# EAGLE design Control2 (EAGLE 7.5.0)
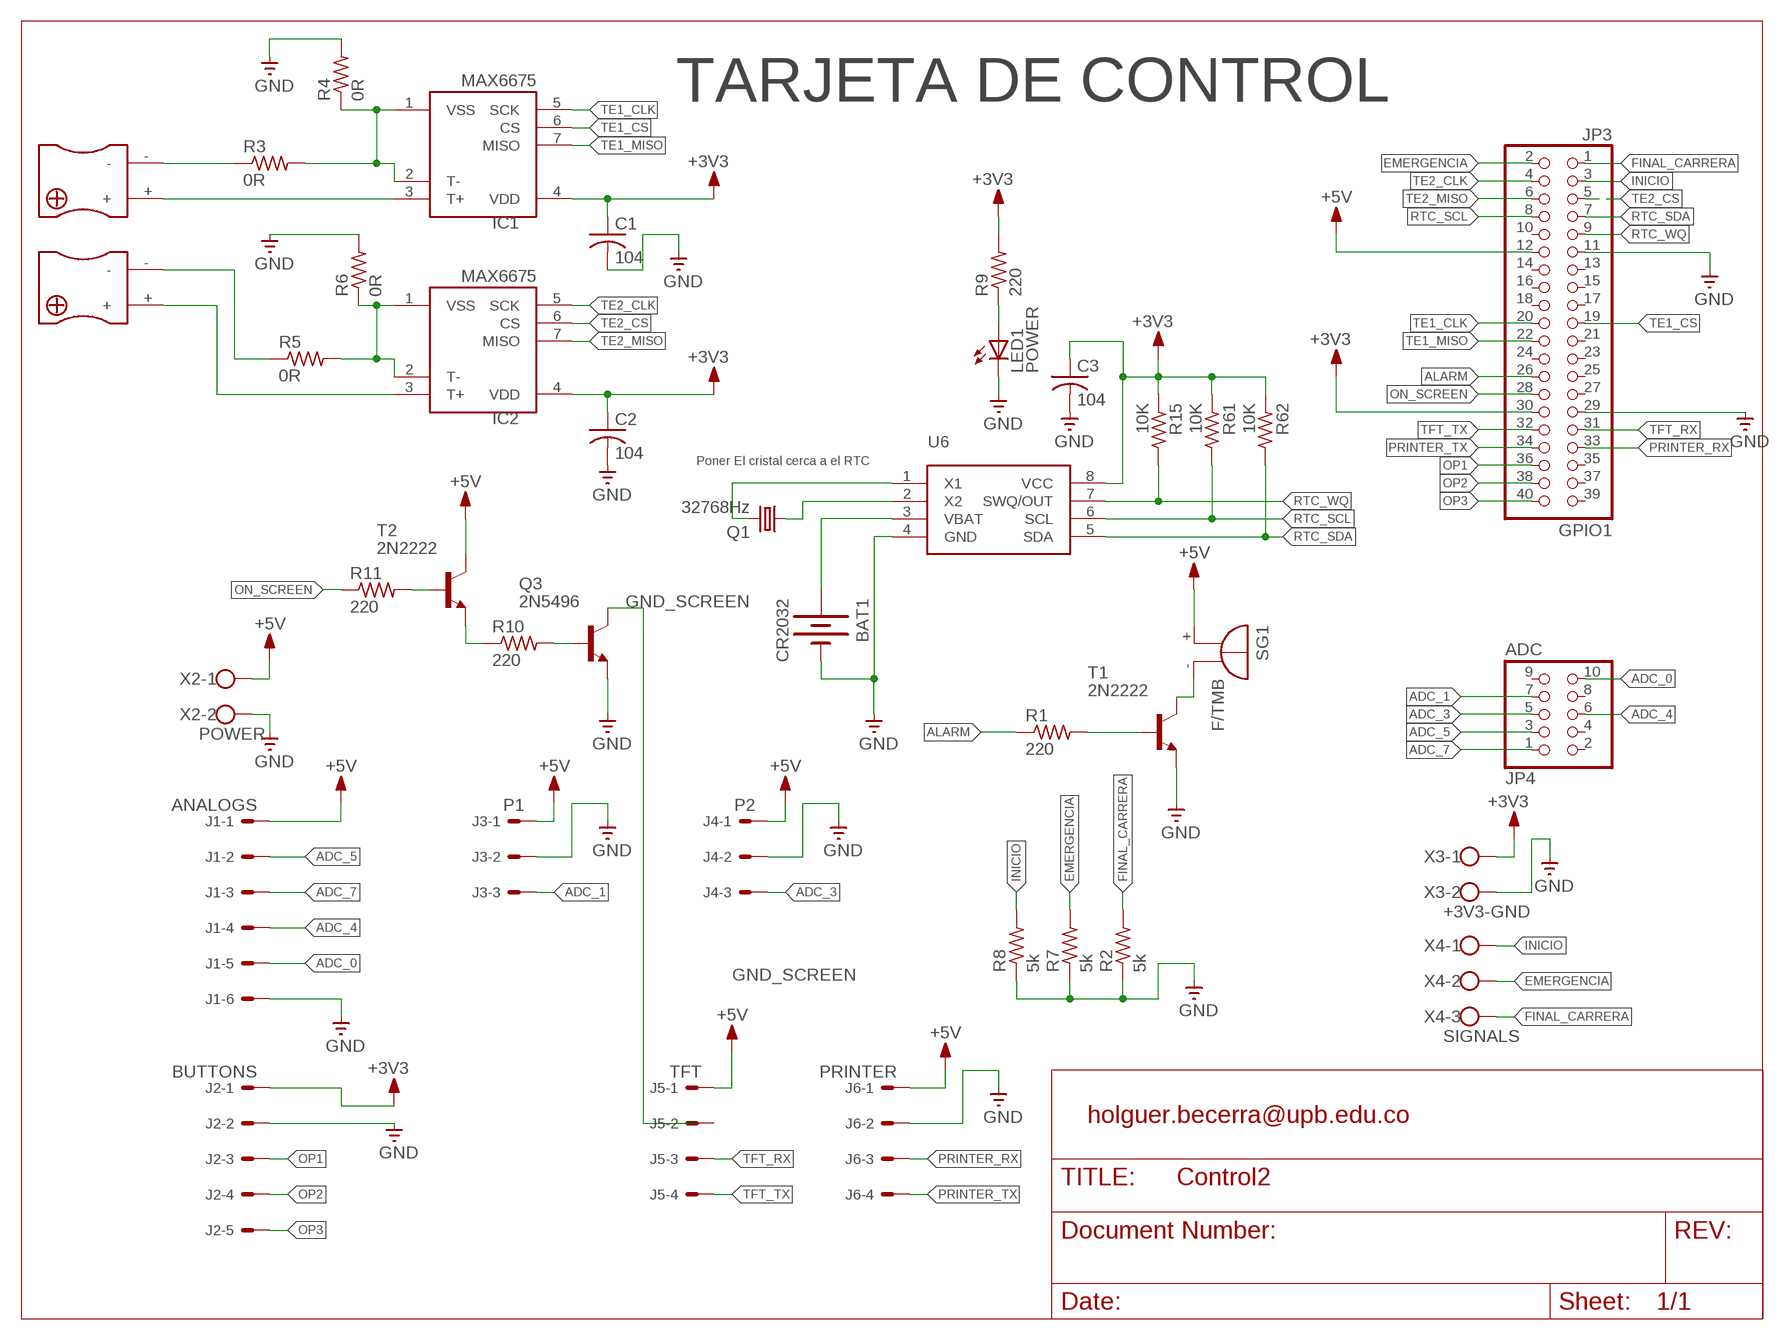
[diagram p0: schematic, sheet 1]

## Parts
BAT1  CR2032  BATTERY20PTH  [BATTCOM_20MM_PTH]
C1  104  C-USC0805  [C0805]
C2  104  C-USC0805  [C0805]
C3  104  C-USC0805  [C0805]
IC1  MAX6675  [SO08]
IC2  MAX6675  [SO08]
J1  ANALOGS  22-27-2061-06  [6410-06]
J2  BUTTONS  22-27-2051-05  [6410-05]
J3  P1  22-27-2031-03  [6410-03]
J4  P2  22-27-2031-03  [6410-03]
J5  TFT  22-27-2041-04  [6410-04]
J6  PRINTER  22-27-2041-04  [6410-04]
JP3  GPIO1  PINHD-2X20  [2X20]
JP4  ADC  PINHD-2X5  [2X05]
LED1  POWER  LED3MM  [LED3MM]
Q1  32768Hz  CRYSTALTC26H  [TC26H]
Q3  2N5496  [TO220]
R1  220  R-US_0207/7  [0207/7]
R2  5k  R-US_0207/7  [0207/7]
R3  0R  R-US_M1206  [M1206]
R4  0R  R-US_M1206  [M1206]
R5  0R  R-US_M1206  [M1206]
R6  0R  R-US_M1206  [M1206]
R7  5k  R-US_0207/7  [0207/7]
R8  5k  R-US_0207/7  [0207/7]
R9  220  R-US_0207/7  [0207/7]
R10  220  R-US_0207/7  [0207/7]
R11  220  R-US_0207/7  [0207/7]
R15  10K  R-US_R0603  [R0603]
R61  10K  R-US_R0603  [R0603]
R62  10K  R-US_R0603  [R0603]
SG1  F/TMB  [F/TMB]
T1  2N2222  2N2222-NPN-TO92-EBC  [TO92-EBC]
T2  2N2222  2N2222-NPN-TO92-EBC  [TO92-EBC]
U6  DS1338  [SO08]
U$1  THERMOCOUPLEPLUG_MINI  [TC-MINI]
U$4  THERMOCOUPLEPLUG_MINI  [TC-MINI]
X2  POWER  CBE2  [BE2]
X3  +3V3-GND  CBE2  [BE2]
X4  SIGNALS  CBE3  [BE3]

## Nets
5VCC: J1.1 J3.1 J4.1 J6.1 JP3.12 SG1.+ T2.C X2.1 ; supply symbol labelled +5V
+3V3: C1.1 C2.1 C3.1 IC1.4(VDD) IC2.4(VDD) J2.1 JP3.30 R9.2 R15.1 R61.1 R62.1 U6.8(VCC) X3.1
ADC_0: J1.5 JP4.10
ADC_1: J3.3 JP4.7
ADC_3: J4.3 JP4.5
ADC_4: J1.4 JP4.6
ADC_5: J1.2 JP4.3
ADC_7: J1.3 JP4.1
ALARM: JP3.26 R1.1
EMERGENCIA: JP3.2 R7.2 X4.2
FINAL_CARRERA: JP3.1 R2.2 X4.3
GND: BAT1.2(-) C1.2 C2.2 C3.2 J1.6 J2.2 J3.2 J4.2 J6.2 JP3.11 JP3.29 LED1.K(C) Q3.3(E) R2.1 R4.2 R6.2 R7.1 R8.1 T1.E U6.4(GND) X2.2 X3.2
INICIO: JP3.3 R8.2 X4.1
N$1: Q1.2 U6.1(X1)
N$2: LED1.A R9.1
N$4: SG1.- T1.C
N$5: R1.2 T1.B
N$6: IC1.3(T+) U$1.+
N$7: R5.1 U$4.-
N$8: IC2.3(T+) U$4.+
N$9: Q1.1 U6.2(X2)
N$10: R10.1 T2.E
N$11: R3.1 U$1.-
N$12: Q3.1(B) R10.2
N$13: R11.2 T2.B
N$30: IC2.1(VSS) IC2.2(T-) R5.2 R6.1
N$31: IC1.1(VSS) IC1.2(T-) R3.2 R4.1
N$35: BAT1.1(+) U6.3(VBAT)
ON_SCREEN: JP3.28 R11.1
OP1: J2.3 JP3.36
OP2: J2.4 JP3.38
OP3: J2.5 JP3.40
PRINTER_RX: J6.3 JP3.33
PRINTER_TX: J6.4 JP3.34
RTC_SCL: JP3.8 R61.2 U6.6(SCL)
RTC_SDA: JP3.7 R62.2 U6.5(SDA)
RTC_WQ: JP3.9 R15.2 U6.7(SWQ/OUT)
TE1_CLK: IC1.5(SCK) JP3.20
TE1_CS: IC1.6(CS) JP3.19
TE1_MISO: IC1.7(MISO) JP3.22
TE2_CLK: IC2.5(SCK) JP3.4
TE2_CS: IC2.6(CS) JP3.5
TE2_MISO: IC2.7(MISO) JP3.6
TFT_RX: J5.3 JP3.31
TFT_TX: J5.4 JP3.32
VCC: J5.1 ; supply symbol labelled +5V
Unconnected: J5.2 JP3.10 JP3.13 JP3.14 JP3.15 JP3.16 JP3.17 JP3.18 JP3.21 JP3.23 JP3.24 JP3.25 JP3.27 JP3.35 JP3.37 JP3.39 JP4.2 JP4.4 JP4.8 JP4.9 Q3.2(C)

## Notes on the sheet
- TARJETA DE CONTROL
- Poner El cristal cerca a el RTC
- holguer.becerra@upb.edu.co

## Library data of the parts
BAT1 = SparkFun:BATTERY: Battery Holders Various common sizes : AA, AAA, 20mm coin cell and 12mm coin cell.
C1-C3 = rcl:C-US: CAPACITOR, American symbol
IC1 IC2 = max6675:MAX6675
J1 = con-molex:22-?-06: CONNECTOR wire to board 2.54 mm (.1 inch) pitch header; OC_FARNELL: unknown; OC_NEWARK: unknown
J2 = con-molex:22-?-05: CONNECTOR wire to board 2.54 mm (.1 inch) pitch header; OC_FARNELL: unknown; OC_NEWARK: unknown
J3 J4 = con-molex:22-?-03: CONNECTOR wire to board 2.54 mm (.1 inch) pitch header; OC_FARNELL: unknown; OC_NEWARK: unknown
J5 J6 = con-molex:22-?-04: CONNECTOR wire to board 2.54 mm (.1 inch) pitch header; OC_FARNELL: unknown; OC_NEWARK: unknown
JP3 = pinhead:PINHD-2X20: PIN HEADER
JP4 = pinhead:PINHD-2X5: PIN HEADER
LED1 = adafruit:LED: LED OSRAM: - CHIPLED LG R971, LG N971, LY N971, LG Q971, LY Q971, LO R971, LY R971 LH N974, LH R974 LS Q976, LO Q976, LY Q976 LO Q996 - Hyper CHIPLED LW Q18S LB Q993, LB Q99A, LB R99A - SideLED LS A670, LO A670, LY A670, LG A670, LP A670 LB A673, LV A673, LT A673, LW A673 LH A674 LY A675 LS A676, LA A676, LO A676, LY A676, LW A676 LS A679, LY A679, LG A679 - Hyper Micro SIDELED® LS Y876, LA Y876, LO Y876, LY Y876 LT Y87S - SmartLED LW L88C, LW L88S LB L89C, LB L89S, LG L890 LS L89K, LO L89K, LY L89K LS L896, LA L896, LO L896, LY L896 - TOPLED LS T670, LO T670, LY T670, LG T670, LP T670 LSG T670, LSP T670, LSY T670, LOP T670, LYG T670 LG T671, LOG T671, LSG T671 LB T673, LV T673, LT T673, LW T673 LH T674 LS T676, LA T676, LO T676, LY T676, LB T676, LH T676, LSB T676, LW T676 LB T67C, LV T67C, LT T67C, LS T67K, LO T67K, LY T67K, LW E67C LS E67B, LA E67B, LO E67B, LY E67B, LB E67C, LV E67C, LT E67C LW T67C LS T679, LY T679, LG T679 LS T770, LO T770, LY T770, LG T770, LP T770 LB T773, LV T773, LT T773, LW T773 LH T774 LS E675, LA E675, LY E675, LS T675 LS T776, LA T776, LO T776, LY T776, LB T776 LHGB T686 LT T68C, LB T68C - Hyper Mini TOPLED® LB M676 - Mini TOPLED Santana® LG M470 LS M47K, LO M47K, LY M47K Source: http://www.osram.convergy.de/
Q1 = crystal:CRYSTAL: CRYSTAL; OC_FARNELL: unknown; OC_NEWARK: unknown
Q3 = transistor:2N5496: NPN TRANSISTOR
R1-R11 = resistor:R-US_: RESISTOR, American symbol
R15 R61 R62 = rcl:R-US_: RESISTOR, American symbol
SG1 = buzzer:F/TMB: BUZZER Source: Buerklin
T1 T2 = transistor-neu-to92:*-NPN-: NPN Transistror
U6 = STERICLINIC:DS1338
U$1 U$4 = max6675:THERMOCOUPLEPLUG_MINI
X2 X3 = Bornera_tornillo_enchufable:CBE2
X4 = Bornera_tornillo_enchufable:CBE3

## Board
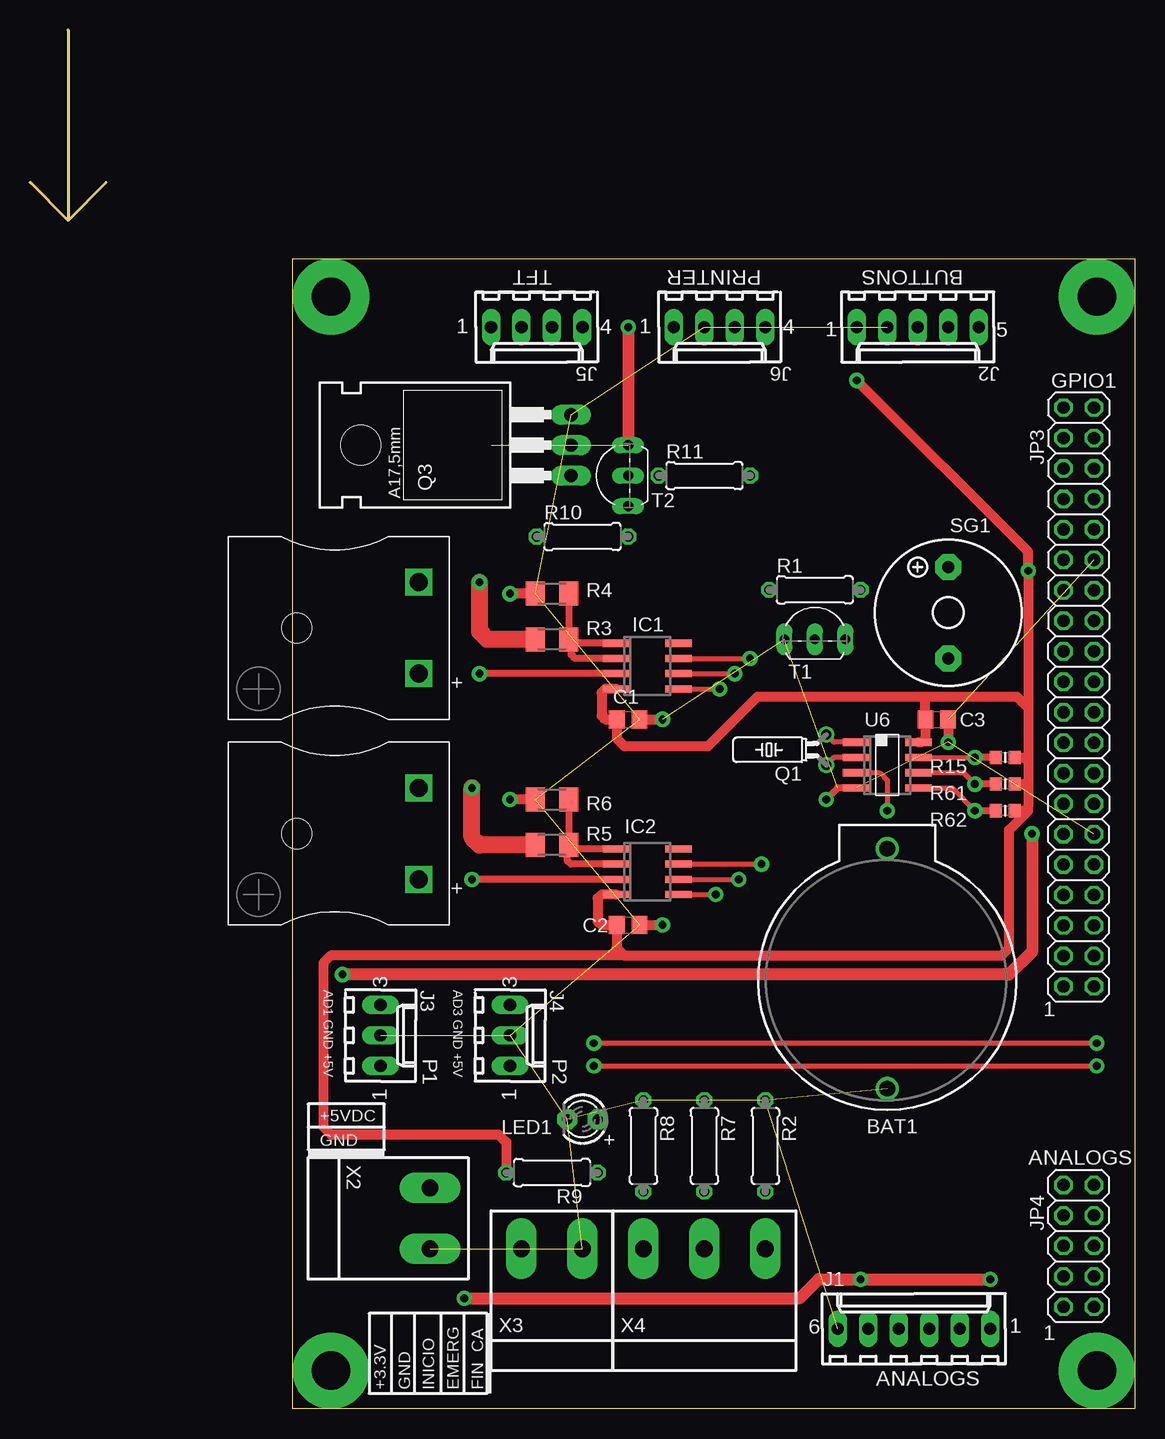
[diagram p1: board, top side]
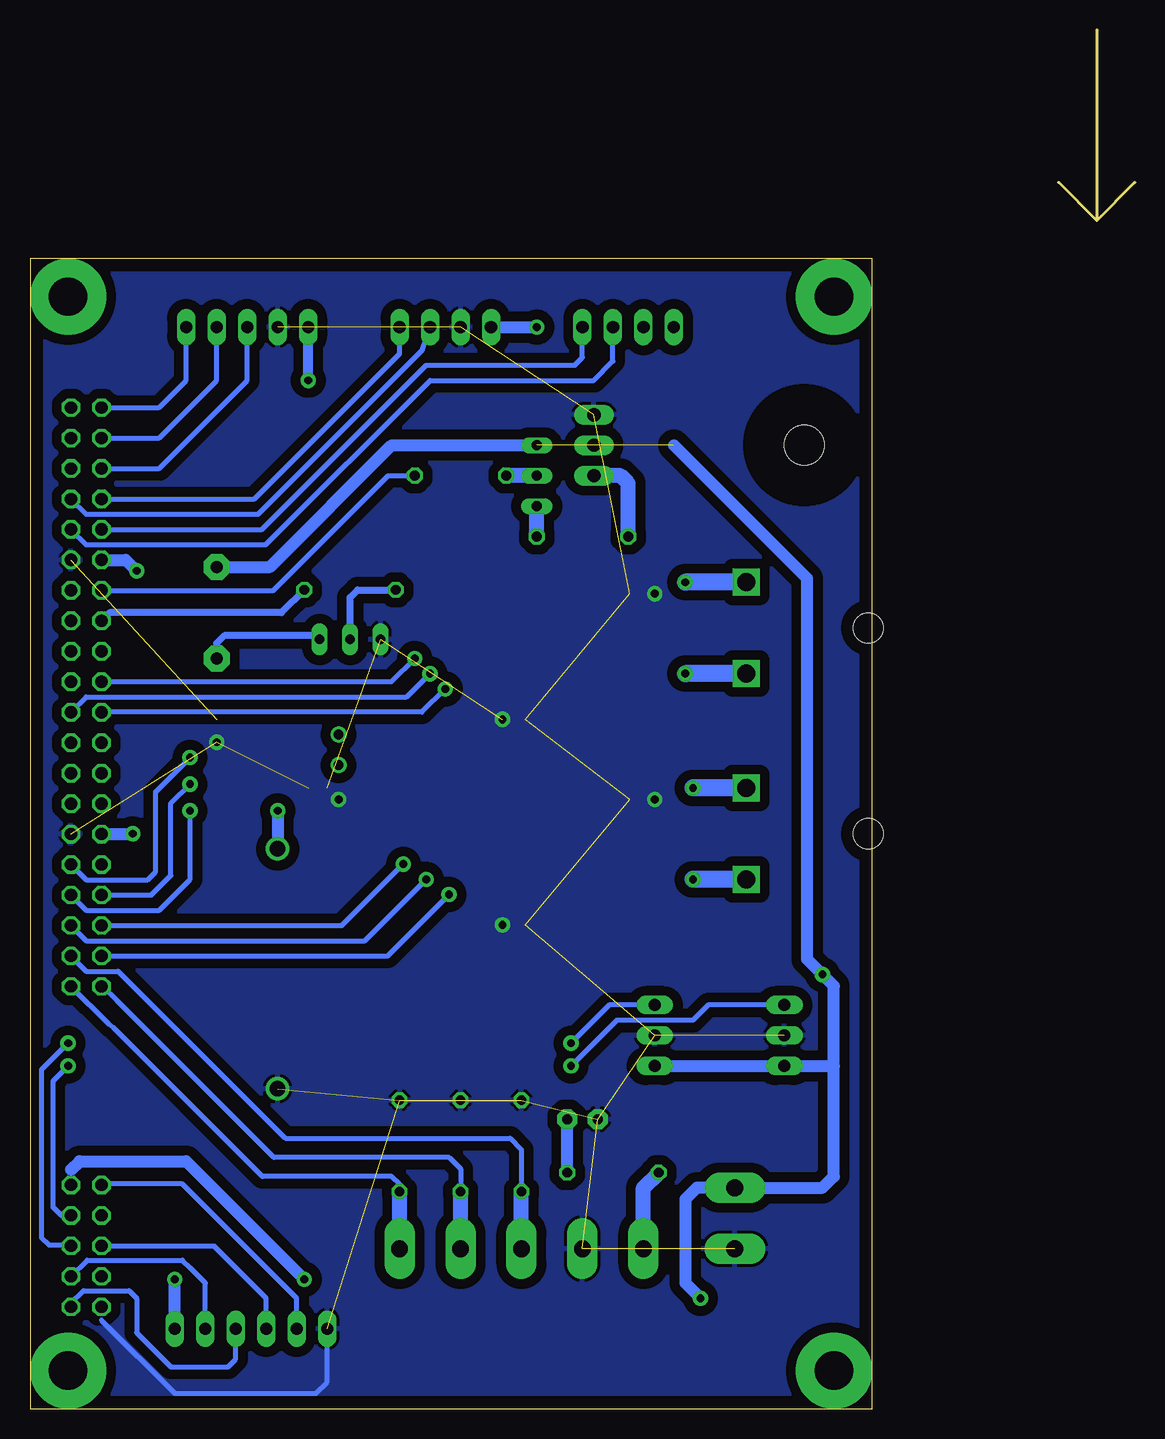
[diagram p2: board, bottom side, seen from below]

Size 92.08 x 114.94 mm. Coordinates in mm from the lower left corner, seen from the top.
Outline: 3.17,114.94 3.17,99.06
Outline: 3.17,99.06 0,102.23
Outline: 6.35,102.23 3.17,99.06
Outline: 92.08,0 21.91,0 21.91,95.89 92.08,95.89 92.08,0
Copper layers (1*16): Top 0.035mm / dielectric 1.5mm / Bottom 0.035mm
Design rules "default": minimum track width 10mil, minimum drill 24mil, track to track 8mil, track to pad 8mil, pad to pad 8mil, via to via 8mil, smd to smd 8mil, copper to edge 40mil, drill to drill 8mil, minimum pad ring 10mil, minimum via ring 8mil, stop-mask expansion 4mil, vias tented up to drill 0mil, thermal gap 10mil

### Footprints (pad centres in the part's own frame; a part is rotated, then mirrored left to right if it is on the bottom)
BATTCOM_20MM_PTH = drill 1.3: 1 20,0; 2 0,0
C0805 = smd 1.3 x 1.5: 1 -0.95,0; 2 0.95,0
SO08 = smd 0.6 x 2.2: 1 -1.905,-2.6; 2 -0.635,-2.6; 3 0.635,-2.6; 4 1.905,-2.6; 5 1.905,2.6; 6 0.635,2.6; 7 -0.635,2.6; 8 -1.905,2.6
6410-06 = drill 1.016 long: 1 6.35,0; 2 3.81,0; 3 1.27,0; 4 -1.27,0; 5 -3.81,0; 6 -6.35,0
6410-05 = drill 1.016 long: 1 5.08,0; 2 2.54,0; 3 0,0; 4 -2.54,0; 5 -5.08,0
6410-03 = drill 1.016 long: 1 2.54,0; 2 0,0; 3 -2.54,0
6410-04 = drill 1.016 long: 1 3.81,0; 2 1.27,0; 3 -1.27,0; 4 -3.81,0
2X20 = drill 1.016 octagon: 1 -24.13,-1.27; 2 -24.13,1.27; 3 -21.59,-1.27; 4 -21.59,1.27; 5 -19.05,-1.27; 6 -19.05,1.27; 7 -16.51,-1.27; 8 -16.51,1.27; 9 -13.97,-1.27; 10 -13.97,1.27; 11 -11.43,-1.27; 12 -11.43,1.27; 13 -8.89,-1.27; 14 -8.89,1.27; 15 -6.35,-1.27; 16 -6.35,1.27; 17 -3.81,-1.27; 18 -3.81,1.27; 19 -1.27,-1.27; 20 -1.27,1.27; 21 1.27,-1.27; 22 1.27,1.27; 23 3.81,-1.27; 24 3.81,1.27; 25 6.35,-1.27; 26 6.35,1.27; 27 8.89,-1.27; 28 8.89,1.27; 29 11.43,-1.27; 30 11.43,1.27; 31 13.97,-1.27; 32 13.97,1.27; 33 16.51,-1.27; 34 16.51,1.27; 35 19.05,-1.27; 36 19.05,1.27; 37 21.59,-1.27; 38 21.59,1.27; 39 24.13,-1.27; 40 24.13,1.27
2X05 = drill 1.016 octagon: 1 -5.08,-1.27; 2 -5.08,1.27; 3 -2.54,-1.27; 4 -2.54,1.27; 5 0,-1.27; 6 0,1.27; 7 2.54,-1.27; 8 2.54,1.27; 9 5.08,-1.27; 10 5.08,1.27
LED3MM = drill 0.813 pad 1.676 octagon: A -1.27,0; K 1.27,0
TC26H = drill 0.813: 1 -1.27,0; 2 1.27,0
TO220 = drill 1.118 long: 1 -2.54,-6.35; 2 0,-6.35; 3 2.54,-6.35 | hole 3.302: 0,11.176
0207/7 = drill 0.813 octagon: 1 -3.81,0; 2 3.81,0
M1206 = smd 1.6 x 2: 1 -1.4,0; 2 1.4,0
R0603 = smd 1 x 1.1: 1 -0.794,0; 2 0.794,0
F/TMB = drill 1.016 pad 2.159 octagon: + 3.81,0; - -3.81,0
TO92-EBC = drill 0.813 long: B 0,-1.27; C 2.54,-1.27; E -2.54,-1.27
TC-MINI = drill 1.5 square: + -3.81,0; - 3.81,0 | hole 2.5: 0,10.16
BE2 = drill 1.4 pad 2.54 long: 1 -2.54,0; 2 2.54,0
BE3 = drill 1.4 pad 2.54 long: 1 -5.08,0; 2 0,0; 3 5.08,0

### Placement (x,y rotation side)
BAT1  71.44,26.67 90 top
C1  49.85,57.47 0 top
C2  49.85,40.32 0 top
C3  75.56,57.47 0 top
IC1  51.44,61.91 270 top
IC2  51.44,44.77 270 top
J1  73.66,6.67 0 top
J2  73.98,90.17 180 top
J3  29.21,31.11 270 top
J4  40.01,31.11 270 top
J5  42.23,90.17 180 top
J6  57.47,90.17 180 top
JP3  87.39,59.33 90 top
JP4  87.39,13.57 90 top
LED1  46.04,24.13 180 top
Q1  66.36,54.93 90 top
Q3  38.73,80.33 90 top
R1  65.41,68.26 180 top
R2  61.28,21.91 270 top
R3  43.5,64.14 0 top
R4  43.5,67.94 180 top
R5  43.5,46.99 0 top
R6  43.5,50.8 180 top
R7  56.2,21.91 270 top
R8  51.12,21.91 270 top
R9  43.5,19.68 180 top
R10  46.04,72.71 180 top
R11  56.2,77.79 180 top
R15  81.28,54.29 180 top
R61  81.28,52.07 180 top
R62  81.28,49.85 180 top
SG1  76.52,66.36 90 top
T1  65.41,65.41 0 top
T2  48.58,77.79 90 top
U6  71.44,53.66 270 top
U$1  32.39,65.09 90 top
U$4  32.39,47.94 90 top
X2  33.34,15.88 270 top
X3  43.5,13.34 0 top
X4  56.2,13.34 0 top

### Tracks (layer width: path | path; a pad name or v marks a point on that pad's centre or on a via)
5VCC  (via drill 0.65 pad 1.27)  (1 unrouted)
  Top 1.016: v49.85,90.17 T2.C | v83.5,47.94 83.5,38.1 81.6,36.2 v26.03,36.2 | v36.2,9.21 64.14,9.21 65.72,10.79 v69.22,10.79 v80.01,10.79
  Bottom 1.016: SG1.+ 72.07,70.17 61.91,80.33 T2.C | J6.1 v49.85,90.17 | 25.08,28.57 25.08,19.37 26.03,18.41 X2.1 36.51,18.41 37.47,17.46 37.47,10.48 v36.2,9.21 | 25.08,28.57 25.08,35.24 v26.03,36.2 27.31,37.47 27.31,69.22 38.42,80.33 | JP3.12 83.54,47.9 v83.5,47.94 | J1.1 v80.01,10.79 | J4.1 J3.1 25.08,28.57 | 88.66,19.92 87.95,20.64 79.06,20.64 v69.22,10.79
+3V3  (via drill 0.65 pad 1.27)
  Top 0.6: C3.1
  Top 0.813: 74.61,59.37 60.64,59.37 56.52,55.24 49.53,55.24 48.9,55.88 C1.1 47.94,57.47 47.62,57.78 47.62,59.69 47.94,60.01 IC1.4 | 74.61,59.37 82.23,59.37 83.19,58.42 | 83.19,58.42 83.19,54.29 | 83.19,54.29 83.19,52.07 | 83.19,52.07 83.19,50.16 | 83.19,50.16 82.87,49.85 R62.1 | R61.1 83.19,52.07 | R15.1 83.19,54.29 | U6.8 74.3,55.56 74.62,55.88 C3.1 | C3.1 74.61,59.37 | IC2.4 47.62,42.86 47.31,42.55 47.31,40.64 47.62,40.32 C2.1 | C2.1 | 83.19,58.42 v83.19,69.85 83.19,71.44 v68.9,85.72 | C2.1 48.9,38.42 49.53,37.78 | 49.53,37.78 80.96,37.78 81.6,38.42 81.6,48.26 83.19,49.85 83.19,50.16 | 49.53,37.78 25.08,37.78 24.45,37.15 24.45,23.5 25.08,22.86 39.05,22.86 39.69,22.23 R9.2
  Bottom 0.813: v68.9,85.72 J2.1
  Bottom 1.016: JP3.30 84.1,70.76 v83.19,69.85
  Bottom 1.27: X3.1 40.96,18.41 R9.2
ADC_0
  Bottom 0.406: J1.5 69.85,9.21 79.38,18.73 86.04,18.73 JP4.10
ADC_1  (via drill 0.65 pad 1.27)
  Top 0.406: v46.99,28.57 v88.9,28.57
  Bottom 0.406: J3.3 35.56,33.66 36.83,32.38 43.18,32.38 v46.99,28.57 | v88.9,28.57 90.17,27.3 90.17,16.83 89.46,16.11 JP4.7
ADC_3  (via drill 0.65 pad 1.27)
  Top 0.406: v46.99,30.48 v88.9,30.48
  Bottom 0.406: v88.9,30.48 91.12,28.26 91.12,14.29 90.49,13.65 88.74,13.65 JP4.5 | J4.3 43.82,33.66 v46.99,30.48
ADC_4
  Bottom 0.406: J1.4 72.39,9.21 76.76,13.57 JP4.6
ADC_5
  Bottom 0.406: J1.2 77.47,10.48 78.26,11.27 78.74,11.75 79.38,12.38 87.31,12.38 JP4.3
ADC_7
  Bottom 0.406: JP4.1 88.66,8.81 87.63,9.84 83.82,9.84 83.19,9.21 83.19,6.35 80.33,3.49 75.56,3.49 74.93,4.13 J1.3
ALARM
  Bottom 0.6: R1.1 71.12,66.36 85.45,66.36 JP3.26
EMERGENCIA
  Bottom 0.406: JP3.2 86.08,35.24 84.81,34.01 71.75,20.95 57.15,20.95 56.2,20 R7.2
  Bottom 1.27: X4.2 R7.2
FINAL_CARRERA
  Bottom 0.406: JP3.1 85.53,32.07 85.09,31.75 72.71,19.37 61.91,19.37 61.28,18.73 R2.2
  Bottom 1.27: X4.3 R2.2
GND  (via drill 0.65 pad 1.27)  (21 unrouted)
  Top 0.6: U6.4 67.31,51.75 v66.36,50.8
  Top 0.813: C3.2 76.52,57.15 v76.52,55.56 | C2.2 v52.71,40.32 | C1.2 v52.71,57.47 | R6.2 v40.01,50.8 | R4.2 v40.01,67.94
  Bottom 0.406: 86.12,7.38 80.01,1.27 68.26,1.27 67.31,2.22 J1.6
  pour Bottom (isolate 0.813): 21.59,96.2 92.39,96.2 92.39,-0.32 21.59,-0.32
INICIO
  Bottom 0.406: JP3.3 87.39,36.47 84.73,36.47 70.8,22.54 52.07,22.54 51.12,21.59 R8.2
  Bottom 1.27: X4.1 R8.2
N$1
  Top 0.406: U6.1 66.99,55.56 Q1.2
N$2
  Bottom 1.016: R9.1 LED1.A
N$4
  Bottom 0.6: T1.C 67.95,64.45 75.88,64.45 76.52,63.82 SG1.-
N$5
  Bottom 0.6: T1.B 65.41,67.63 64.77,68.26 R1.2
N$6  (via drill 0.65 pad 1.27)
  Top 0.6: IC1.3 v37.47,61.28
  Bottom 1.422: U$1.+ v37.47,61.28
N$7  (via drill 0.65 pad 1.27)
  Top 1.422: R5.1 37.47,46.99 36.83,47.62 v36.83,51.75
  Bottom 1.422: U$4.- v36.83,51.75
N$8  (via drill 0.65 pad 1.27)
  Top 0.6: IC2.3 v36.83,44.13
  Bottom 1.422: U$4.+ v36.83,44.13
N$9
  Top 0.406: U6.2 66.99,54.29 Q1.1
N$10
  Bottom 1.27: R10.1 T2.E
N$11  (via drill 0.65 pad 1.27)
  Top 1.422: R3.1 38.1,64.14 37.47,64.77 v37.47,68.9
  Bottom 1.422: U$1.- v37.47,68.9
N$12
  Bottom 1.27: R10.2 42.23,77.15 42.86,77.79 Q3.1
N$13
  Bottom 1.27: T2.B R11.2
N$14  (via drill 3.2 pad 6.35)
  other vias: 25.08,92.71
N$15  (via drill 3.2 pad 6.35)
  other vias: 88.9,92.71
N$16  (via drill 3.2 pad 6.35)
  other vias: 88.9,3.17
N$17  (via drill 3.2 pad 6.35)
  other vias: 25.08,3.17
N$30
  Top 0.6: IC2.2 45.09,45.4 44.77,45.72 44.77,46.86 R5.2 | R6.1 R5.2 | IC2.1 45.22,46.67 R5.2
N$31
  Top 0.406: 45.09,64 R3.2
  Top 0.6: R4.1 R3.2 45.22,63.82 IC1.1 | IC1.2 45.4,62.55 45.09,62.87 45.09,64
N$35  (via drill 0.65 pad 1.27)
  Top 0.406: U6.3 70.8,53.02 71.44,52.39 v71.44,49.85
  Bottom 1.016: v71.44,49.85 BAT1.1
ON_SCREEN
  Bottom 0.406: JP3.28 71.8,68.22 62.23,77.79 R11.1
OP1
  Bottom 0.406: JP3.36 81.32,78.38 73.98,85.72 J2.3
OP2
  Bottom 0.406: JP3.38 81.32,80.92 76.52,85.72 J2.4
OP3
  Bottom 0.406: JP3.40 81.32,83.46 79.06,85.72 J2.5
PRINTER_RX
  Bottom 0.406: JP3.33 87.39,74.57 73.06,74.57 59.37,88.27 J6.3
PRINTER_TX
  Bottom 0.406: JP3.34 73.38,75.84 61.28,87.95 J6.4
RTC_SCL  (via drill 0.65 pad 1.27)
  Top 0.406: U6.6 77.79,53.02 v78.74,52.07
  Top 0.6: R61.2 v78.74,52.07
  Bottom 0.406: JP3.8 81.95,42.82 80.33,44.45 80.33,50.48 v78.74,52.07
RTC_SDA  (via drill 0.65 pad 1.27)
  Top 0.406: U6.5 76.84,51.75 v78.74,49.85
  Top 0.6: R62.2 v78.74,49.85
  Bottom 0.406: JP3.7 87.39,41.55 81.32,41.55 78.74,44.13 v78.74,49.85
RTC_WQ  (via drill 0.65 pad 1.27)
  Top 0.406: U6.7 v78.74,54.29
  Top 0.6: R15.2 v78.74,54.29
  Bottom 0.406: JP3.9 87.39,44.09 82.27,44.09 81.6,44.77 81.6,51.44 v78.74,54.29
TE1_CLK  (via drill 0.65 pad 1.27)
  Top 0.406: IC1.5 v57.47,60.01
  Bottom 0.406: v57.47,60.01 59.41,58.06 JP3.20
TE1_CS  (via drill 0.65 pad 1.27)
  Top 0.406: IC1.6 v58.74,61.28
  Bottom 0.406: JP3.19 87.39,59.33 60.68,59.33 v58.74,61.28
TE1_MISO  (via drill 0.65 pad 1.27)
  Top 0.406: IC1.7 v60.01,62.55
  Bottom 0.406: JP3.22 61.95,60.6 v60.01,62.55
TE2_CLK  (via drill 0.65 pad 1.27)
  Top 0.406: IC2.5 v57.15,42.86
  Bottom 0.406: JP3.4 62.27,37.74 v57.15,42.86
TE2_CS  (via drill 0.65 pad 1.27)
  Top 0.406: IC2.6 v59.05,44.13
  Bottom 0.406: JP3.5 87.39,39.01 64.18,39.01 v59.05,44.13
TE2_MISO  (via drill 0.65 pad 1.27)
  Top 0.406: IC2.7 v60.96,45.4
  Bottom 0.406: JP3.6 66.08,40.28 v60.96,45.4
TFT_RX
  Bottom 0.406: JP3.31 87.39,72.03 72.43,72.03 58.74,85.72 45.09,85.72 43.5,87.31 J5.3
TFT_TX
  Bottom 0.406: JP3.32 72.75,73.3 59.05,87 46.67,87 46.04,87.63 J5.4

### Text on the board
tPlace: TFT | PRINTER | BUTTONS | GPIO1 | AD1 GND +5V | AD3 GND +5V | 1 | P1 | P2 | +5VDC / GND | ANALOGS | 1 | +3.3V / GND / INICIO / EMERG / FIN_CA | ANALOGS